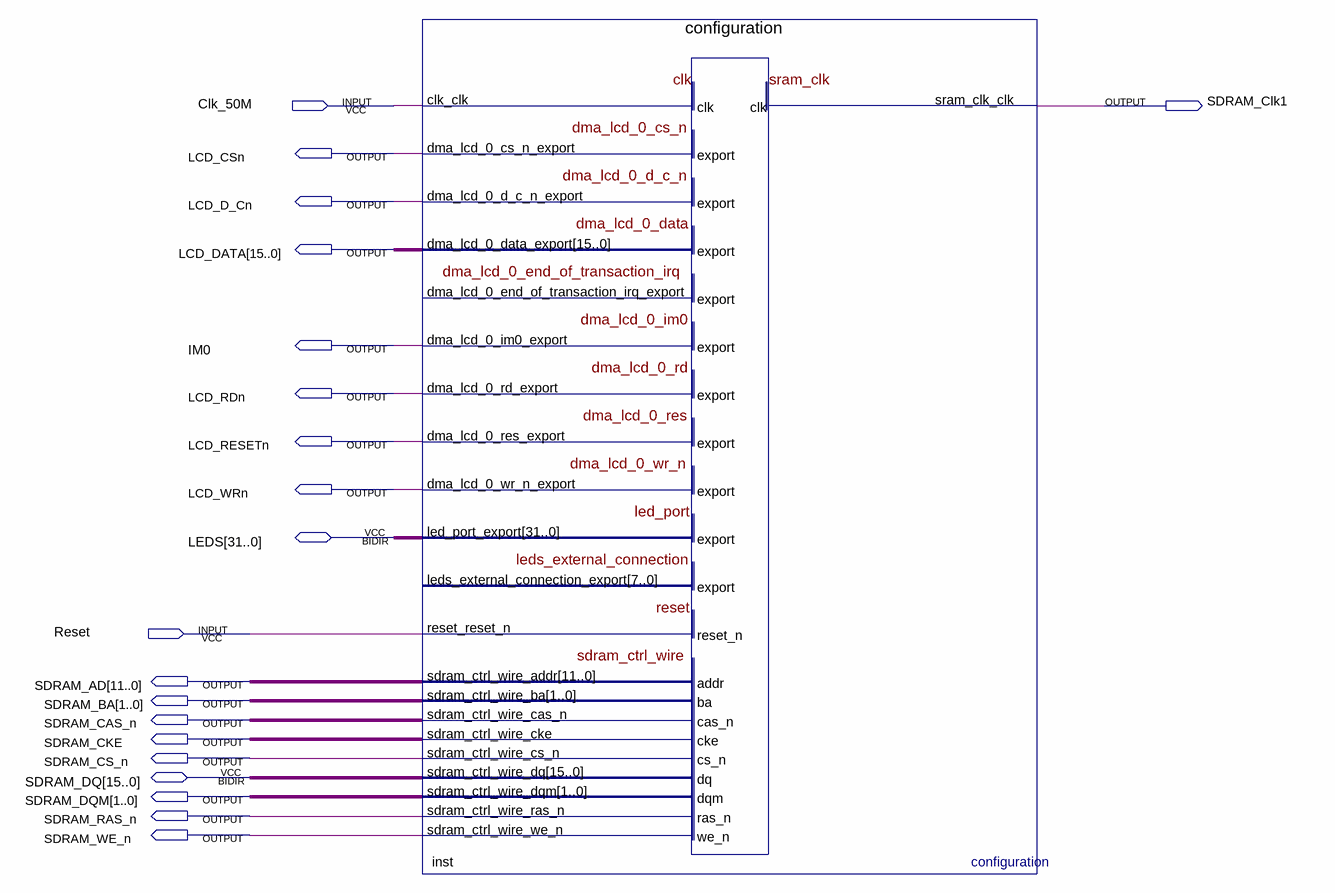
[diagram p0: schematic sheet]
// Quartus schematic test1.bdf as structural Verilog: 1 symbols, 20 pins
module test1 (
  input  Clk_50M,
  input  Reset,
  inout  [31:0] LEDS,
  inout  [15:0] SDRAM_DQ,
  output SDRAM_Clk1,
  output LCD_CSn,
  output LCD_D_Cn,
  output [15:0] LCD_DATA,
  output IM0,
  output LCD_RDn,
  output LCD_RESETn,
  output LCD_WRn,
  output [11:0] SDRAM_AD,
  output [1:0] SDRAM_BA,
  output SDRAM_CAS_n,
  output SDRAM_CKE,
  output SDRAM_CS_n,
  output [1:0] SDRAM_DQM,
  output SDRAM_RAS_n,
  output SDRAM_WE_n
);

  configuration inst (
    .clk_clk(Clk_50M), .reset_reset_n(Reset), .dma_lcd_0_cs_n_export(LCD_CSn),
    .dma_lcd_0_d_c_n_export(LCD_D_Cn), .dma_lcd_0_data_export(LCD_DATA), .dma_lcd_0_im0_export(IM0),
    .dma_lcd_0_rd_export(LCD_RDn), .dma_lcd_0_res_export(LCD_RESETn), .dma_lcd_0_wr_n_export(LCD_WRn),
    .sdram_ctrl_wire_addr(SDRAM_AD), .sdram_ctrl_wire_ba(SDRAM_BA), .sdram_ctrl_wire_cas_n(SDRAM_CAS_n),
    .sdram_ctrl_wire_cke(SDRAM_CKE), .sdram_ctrl_wire_cs_n(SDRAM_CS_n), .sdram_ctrl_wire_dqm(SDRAM_DQM),
    .sdram_ctrl_wire_ras_n(SDRAM_RAS_n), .sdram_ctrl_wire_we_n(SDRAM_WE_n), .sram_clk_clk(SDRAM_Clk1),
    .led_port_export(LEDS), .sdram_ctrl_wire_dq(SDRAM_DQ));  // open: dma_lcd_0_end_of_transaction_irq_export, leds_external_connection_export
endmodule
